# EAGLE design lcd-i2c (EAGLE 6.4)
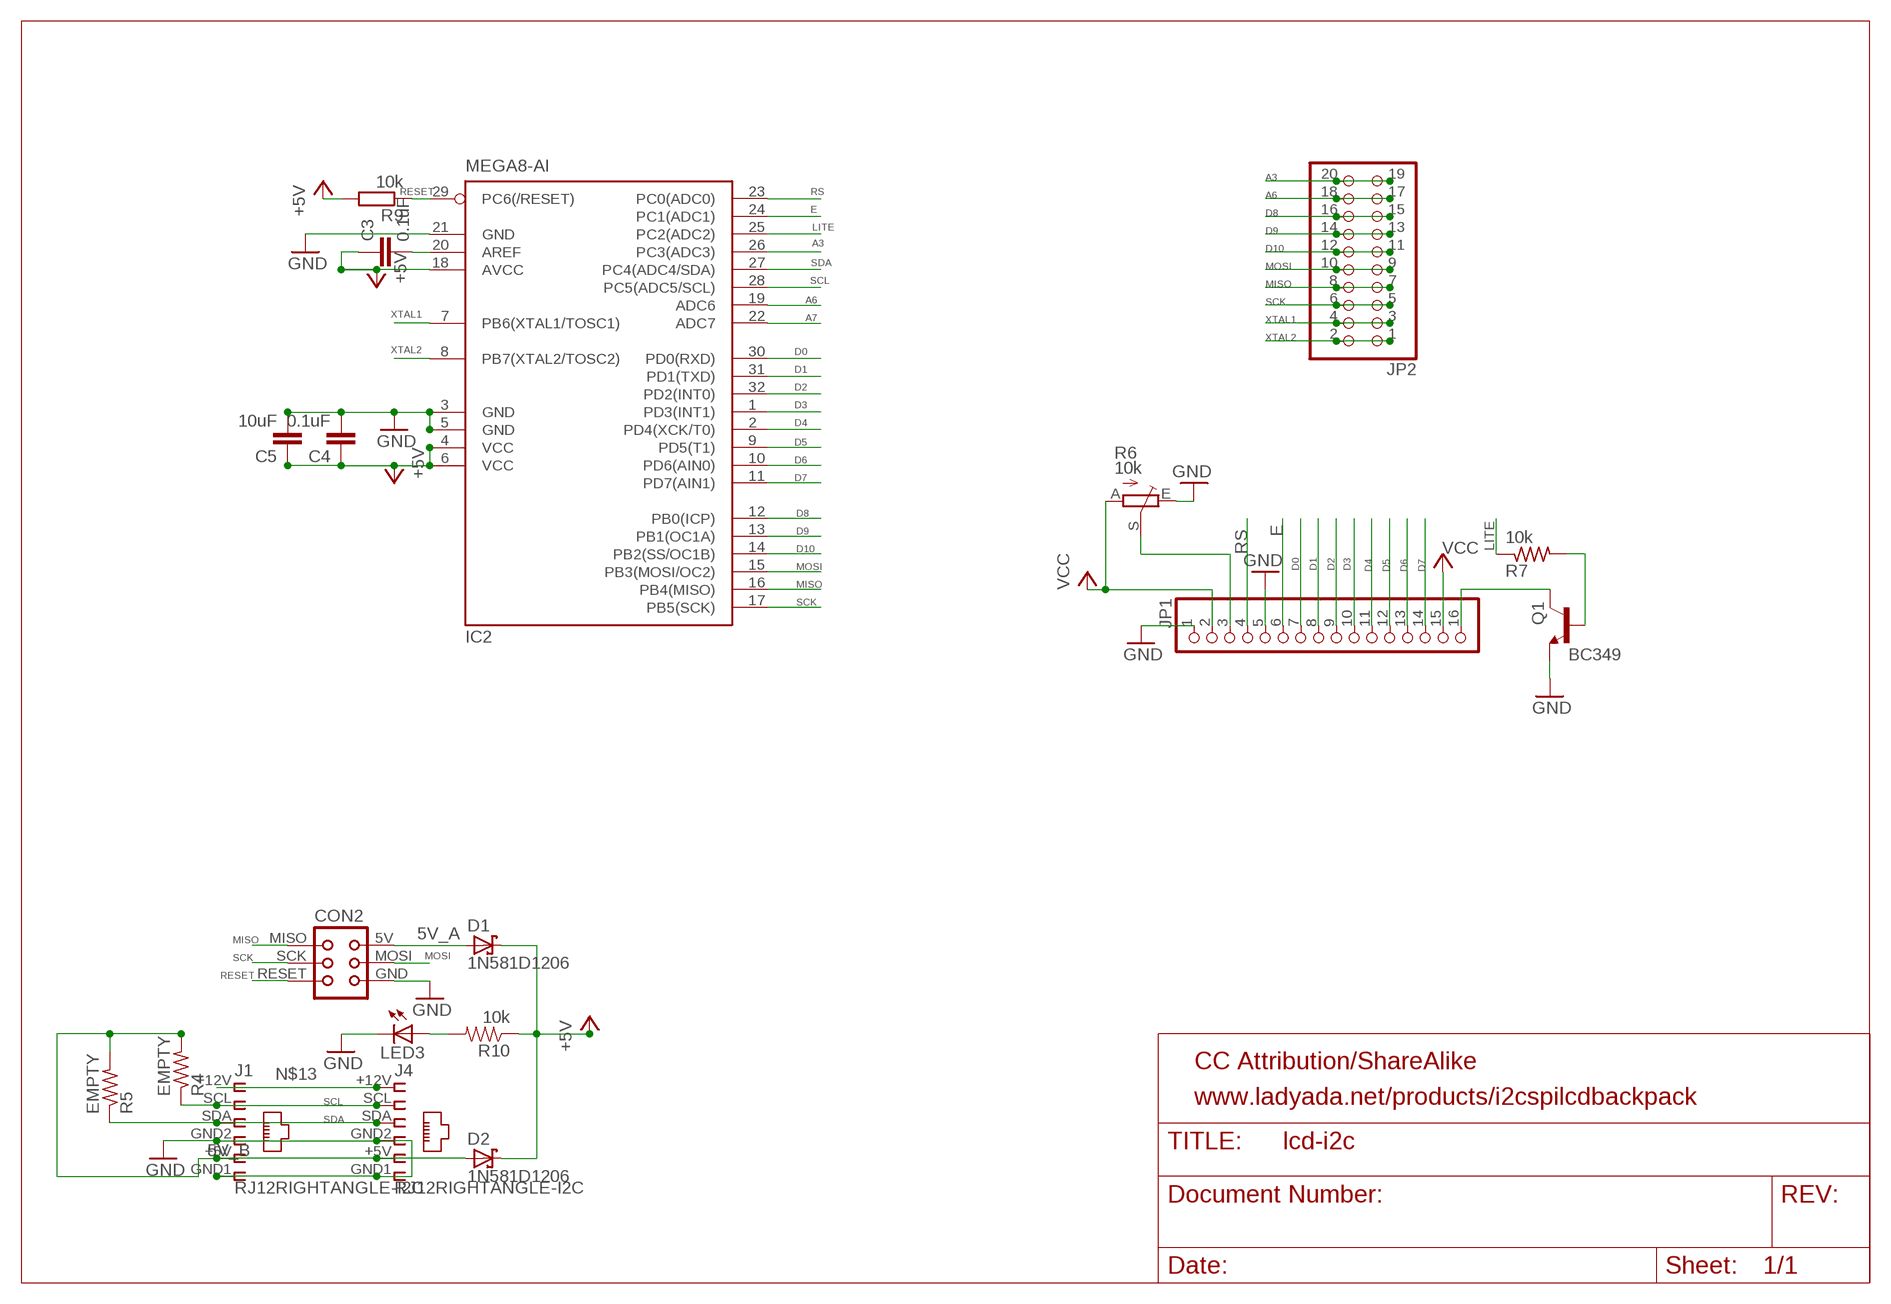
[diagram p0: schematic, sheet 1]

## Parts
C3  0.1uF  C-EUC1206  [C1206]
C4  0.1uF  C-EUC1206  [C1206]
C5  10uF  C-EUC1206  [C1206]
CON2  TINYISPTAG  [TC2030-MCP]
D1  1N581D1206  [LED-1206]
D2  1N581D1206  [LED-1206]
IC2  MEGA8-AI  [TQFP32-08]
J1  RJ12RIGHTANGLE-I2C  [RJ12-RIGHTANGLE-I2C]
J4  RJ12RIGHTANGLE-I2C  [RJ12-RIGHTANGLE-I2C]
JP1  PINHD-1X16  [1X16]
JP2  PINHD-2X10  [2X10]
LED3  LEDCHIP-LED0603  [CHIP-LED0603]
Q1  BC349  BC317-NPN-TO92-EBC  [TO92-EBC]
R4  EMPTY  R-US_M1206  [M1206]
R5  EMPTY  R-US_M1206  [M1206]
R6  10k  TRIM_EU-CA6V  [CA6V]
R7  10k  R-US_M1206  [M1206]
R9  10k  R-EU_M1206  [M1206]
R10  10k  RESISTOR0603-RES  [0603-RES]

## Nets
5V_A [i2c]: CON2.5V(VCC) D1.A
5V_B [power]: D2.A J1.+5V J4.+5V R4.2 R5.2
+5V [power]: C3.1 C4.1 C5.1 D1.C D2.C IC2.4(VCC) IC2.6(VCC) IC2.18(AVCC) R9.2 R10.1
A3: IC2.26(PC3(ADC3)) JP2.19 JP2.20
A6: IC2.19(ADC6) JP2.17 JP2.18
A7: IC2.22(ADC7)
D0: IC2.30(PD0(RXD)) JP1.7
D1: IC2.31(PD1(TXD)) JP1.8
D2: IC2.32(PD2(INT0)) JP1.9
D3: IC2.1(PD3(INT1)) JP1.10
D4: IC2.2(PD4(XCK/T0)) JP1.11
D5: IC2.9(PD5(T1)) JP1.12
D6: IC2.10(PD6(AIN0)) JP1.13
D7: IC2.11(PD7(AIN1)) JP1.14
D8: IC2.12(PB0(ICP)) JP2.15 JP2.16
D9: IC2.13(PB1(OC1A)) JP2.13 JP2.14
D10: IC2.14(PB2(SS/OC1B)) JP2.11 JP2.12
E: IC2.24(PC1(ADC1)) JP1.6
GND [power]: C4.2 C5.2 CON2.GND IC2.3(GND) IC2.5(GND) IC2.21(GND) J1.GND1 J1.GND2 J4.GND1 J4.GND2 JP1.1 JP1.5 LED3.C Q1.E R6.E
LITE: IC2.25(PC2(ADC2)) R7.1
MISO: CON2.MISO IC2.16(PB4(MISO)) JP2.7 JP2.8
MOSI: CON2.MOSI IC2.15(PB3(MOSI/OC2)) JP2.9 JP2.10
N$6: C3.2 IC2.20(AREF)
N$7: JP1.16 Q1.C
N$9: Q1.B R7.2
N$10: JP1.3 R6.S
N$13: J1.+12V J4.+12V
N$15: LED3.A R10.2
RESET: CON2.RESET IC2.29(PC6(/RESET)) R9.1
RS: IC2.23(PC0(ADC0)) JP1.4
SCK: CON2.SCK IC2.17(PB5(SCK)) JP2.5 JP2.6
SCL [i2c]: IC2.28(PC5(ADC5/SCL)) J1.SCL J4.SCL R4.1
SDA [i2c]: IC2.27(PC4(ADC4/SDA)) J1.SDA J4.SDA R5.1
VCC [power]: JP1.2 JP1.15 R6.A
XTAL1: IC2.7(PB6(XTAL1/TOSC1)) JP2.3 JP2.4
XTAL2: IC2.8(PB7(XTAL2/TOSC2)) JP2.1 JP2.2

## Notes on the sheet
- CC Attribution/ShareAlike
- www.ladyada.net/products/i2cspilcdbackpack

## Library data of the parts
C3-C5 = resistor:C-EU: CAPACITOR, European symbol
CON2 = lpatiny:TINYISP: CONNECTOR
D1 D2 = lpatiny:1N581*: 1.0A SCHOTTKY BARRIER RECTIFIER Source: http://www.diodes.com/datasheets/ds23001.pdf
IC2 = atmel:MEGA8: MICROCONTROLLER 8 Kbytes FLASH, 1 kbytes SRAM, 512 bytes EEPROM, USART, 6-channel 10 bit ADC, 2-channel 8 bit ADC Pin compatible with Atmega48, ATMega88, ATMega168 Source: avr.lbr; MPN: ATMEGA8-16AU; OC_FARNELL: 9171371; OC_NEWARK: 73M8863
J1 J4 = lpatiny:RJ12: CORCOM Modular RJ Jacks No Shield Source: www.tycoelectronics.com .. ENG_DS_1654001_1099_RJ_L_0507.pdf
JP1 = pinhead:PINHD-1X16: PIN HEADER
JP2 = pinhead:PINHD-2X10: PIN HEADER
LED3 = adafruit:LED: LED OSRAM: - CHIPLED LG R971, LG N971, LY N971, LG Q971, LY Q971, LO R971, LY R971 LH N974, LH R974 LS Q976, LO Q976, LY Q976 LO Q996 - Hyper CHIPLED LW Q18S LB Q993, LB Q99A, LB R99A - SideLED LS A670, LO A670, LY A670, LG A670, LP A670 LB A673, LV A673, LT A673, LW A673 LH A674 LY A675 LS A676, LA A676, LO A676, LY A676, LW A676 LS A679, LY A679, LG A679 - Hyper Micro SIDELED® LS Y876, LA Y876, LO Y876, LY Y876 LT Y87S - SmartLED LW L88C, LW L88S LB L89C, LB L89S, LG L890 LS L89K, LO L89K, LY L89K LS L896, LA L896, LO L896, LY L896 - TOPLED LS T670, LO T670, LY T670, LG T670, LP T670 LSG T670, LSP T670, LSY T670, LOP T670, LYG T670 LG T671, LOG T671, LSG T671 LB T673, LV T673, LT T673, LW T673 LH T674 LS T676, LA T676, LO T676, LY T676, LB T676, LH T676, LSB T676, LW T676 LB T67C, LV T67C, LT T67C, LS T67K, LO T67K, LY T67K, LW E67C LS E67B, LA E67B, LO E67B, LY E67B, LB E67C, LV E67C, LT E67C LW T67C LS T679, LY T679, LG T679 LS T770, LO T770, LY T770, LG T770, LP T770 LB T773, LV T773, LT T773, LW T773 LH T774 LS E675, LA E675, LY E675, LS T675 LS T776, LA T776, LO T776, LY T776, LB T776 LHGB T686 LT T68C, LB T68C - Hyper Mini TOPLED® LB M676 - Mini TOPLED Santana® LG M470 LS M47K, LO M47K, LY M47K Source: http://www.osram.convergy.de/
Q1 = transistor:*-NPN-: NPN Transistror BF959 corrected 2008.03.06
R4 R5 R7 = adafruit:R-US_: RESISTOR, American symbol
R6 = pot:TRIM_EU-: POTENTIOMETER
R9 = resistor:R-EU_: RESISTOR, European symbol
R10 = SparkFun:RESISTOR: Resistor Basic schematic elements and footprints for 0603, 1206, and PTH resistors.

## Net classes
0 default: width 0.305 mm
1 power: width 0.305 mm
2 i2c: width 0.305 mm

## Board
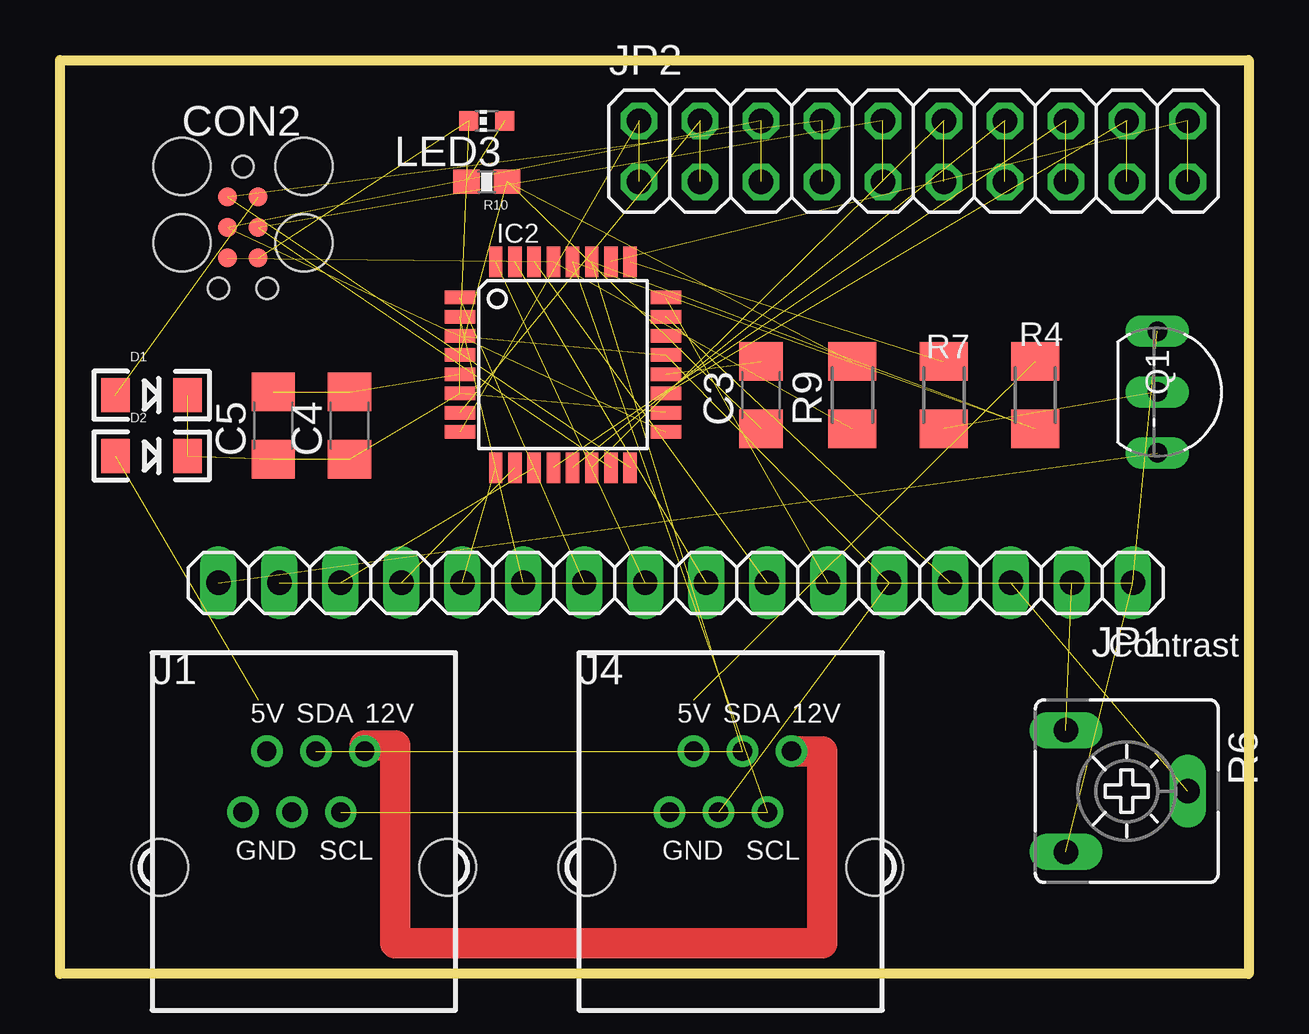
[diagram p1: board, top side]
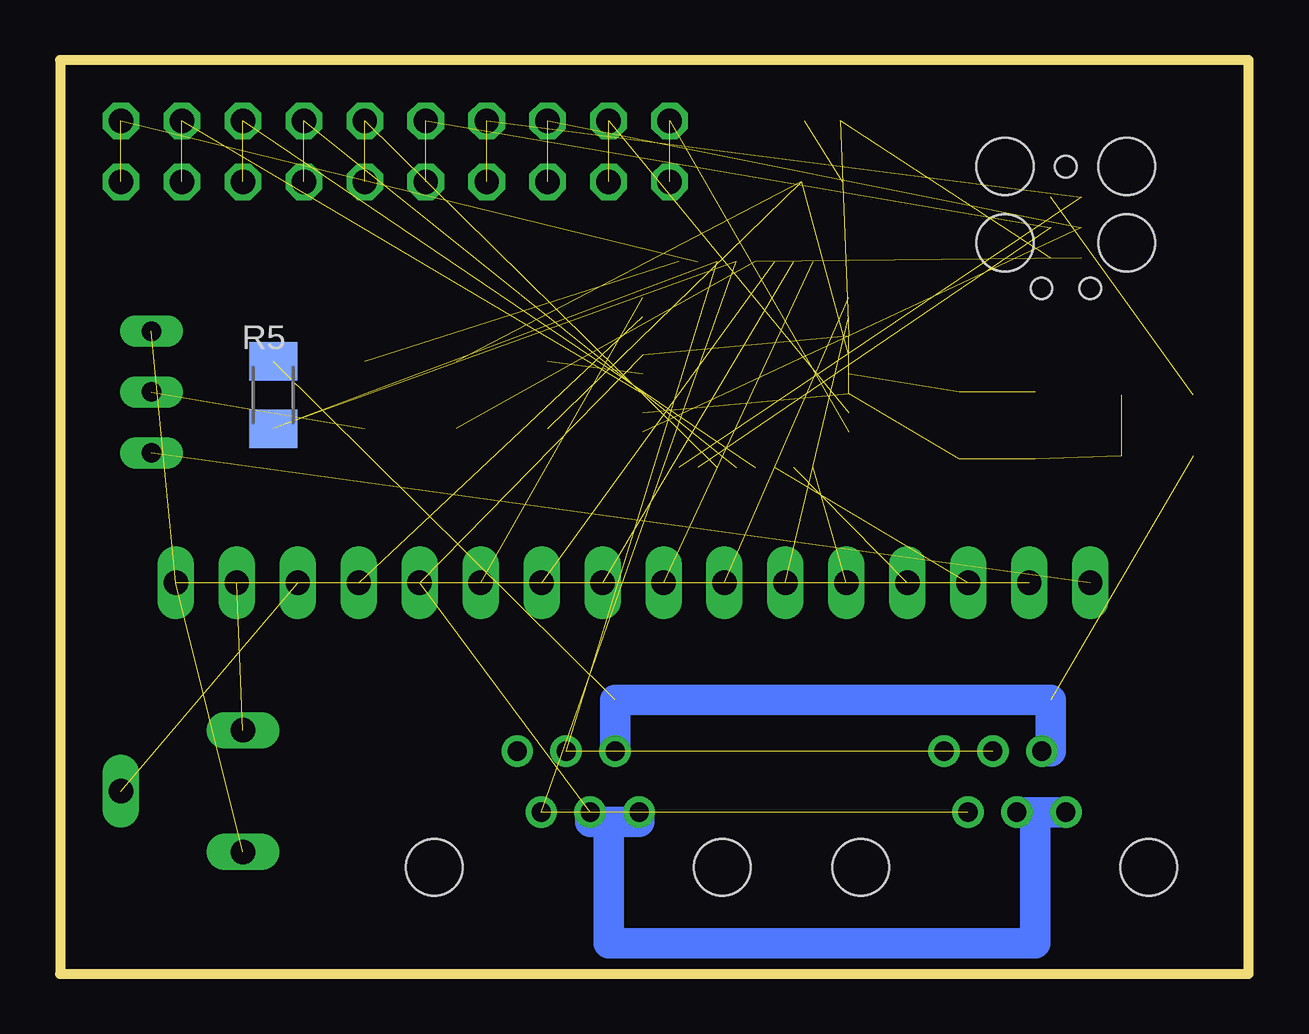
[diagram p2: board, bottom side, seen from below]

Size 49.53 x 38.1 mm. Coordinates in mm from the lower left corner, seen from the top.
Outline: 0,0 0,38.1 49.53,38.1 49.53,0 0,0
Copper layers (1*16): Top 0.035mm / dielectric 1.5mm / Bottom 0.035mm
Design rules "Fusion_eagle_rule_v1.1": minimum track width 6mil, minimum drill 12mil, track to track 6mil, track to pad 6mil, pad to pad 6mil, via to via 6mil, smd to smd 0mil, copper to edge 10mil, drill to drill 10mil, minimum pad ring 10mil, minimum via ring 6mil, stop-mask expansion 2mil, vias tented up to drill 100mil, thermal gap 10mil
vRestrict: area 15.2,19 to 26.7,22.9; area 15.2,27.9 to 26.7,31.8; area 14.6,19.7 to 18.4,31.1; area 23.5,19.7 to 27.3,31.1
Milling: 4 lines

### Footprints (pad centres in the part's own frame; a part is rotated, then mirrored left to right if it is on the bottom)
C1206 = smd 1.6 x 1.8: 1 -1.4,0; 2 1.4,0
TC2030-MCP = smd 0.787 x 0.787: 5V 1.27,0.635; GND 3.81,0.635; MISO 1.27,-0.635; MOSI 2.54,0.635; RESET 3.81,-0.635; SCK 2.54,-0.635 | hole 0.889: 0,0; 5.08,-1.016; 5.08,1.016 | hole 2.375: 0,2.54; 0,-2.54; 3.175,-2.54; 3.175,2.54
LED-1206 = smd 1.2 x 1.4: A -1.5,0; C 1.5,0
TQFP32-08 = smd 1.27 x 0.559: 1 -4.293,2.8; 2 -4.293,2; 3 -4.293,1.2; 4 -4.293,0.4; 5 -4.293,-0.4; 6 -4.293,-1.2; 7 -4.293,-2; 8 -4.293,-2.8; 17 4.293,-2.8; 18 4.293,-2; 19 4.293,-1.2; 20 4.293,-0.4; 21 4.293,0.4; 22 4.293,1.2; 23 4.293,2; 24 4.293,2.8 | smd 0.559 x 1.27: 9 -2.8,-4.293; 10 -2,-4.293; 11 -1.2,-4.293; 12 -0.4,-4.293; 13 0.4,-4.293; 14 1.2,-4.293; 15 2,-4.293; 16 2.8,-4.293; 25 2.8,4.293; 26 2,4.293; 27 1.2,4.293; 28 0.4,4.293; 29 -0.4,4.293; 30 -1.2,4.293; 31 -2,4.293; 32 -2.8,4.293
RJ12-RIGHTANGLE-I2C = drill 0.8 pad 1.3: +5V -1.54,4.84; +12V 2.54,4.84; GND1 -2.54,2.3; GND2 -0.5,2.3; SCL 1.54,2.3; SDA 0.5,4.84 | hole 2.36: -6,0; 6,0
1X16 = drill 1.016 long: 1 -19.05,0; 2 -16.51,0; 3 -13.97,0; 4 -11.43,0; 5 -8.89,0; 6 -6.35,0; 7 -3.81,0; 8 -1.27,0; 9 1.27,0; 10 3.81,0; 11 6.35,0; 12 8.89,0; 13 11.43,0; 14 13.97,0; 15 16.51,0; 16 19.05,0
2X10 = drill 1.016 octagon: 1 -11.43,-1.27; 2 -11.43,1.27; 3 -8.89,-1.27; 4 -8.89,1.27; 5 -6.35,-1.27; 6 -6.35,1.27; 7 -3.81,-1.27; 8 -3.81,1.27; 9 -1.27,-1.27; 10 -1.27,1.27; 11 1.27,-1.27; 12 1.27,1.27; 13 3.81,-1.27; 14 3.81,1.27; 15 6.35,-1.27; 16 6.35,1.27; 17 8.89,-1.27; 18 8.89,1.27; 19 11.43,-1.27; 20 11.43,1.27
CHIP-LED0603 = smd 0.8 x 0.8: A 0,-0.75; C 0,0.75
TO92-EBC = drill 0.813 long: B 0,-1.27; C 2.54,-1.27; E -2.54,-1.27
M1206 = smd 1.6 x 2: 1 -1.4,0; 2 1.4,0
CA6V = drill 1.016 long: A -2.54,-2.54; E 2.54,-2.54; S 0,2.54
0603-RES = smd 1.1 x 1: 1 -0.85,0; 2 0.85,0

### Placement (x,y rotation side)
C3  29.21,24.13 90 top
C4  12.06,22.86 90 top
C5  8.89,22.86 90 top
CON2  7.62,33.66 270 top
D1  3.81,24.13 0 top
D2  3.81,21.59 0 top
IC2  20.95,25.4 0 top
J1  10.16,4.45 0 top
J4  27.94,4.45 0 top
JP1  25.65,16.31 180 top
JP2  35.56,34.29 0 top
LED3  17.78,35.56 90 top
Q1  46.99,24.26 270 top
R4  40.64,24.13 90 top
R5  40.64,24.13 90 bottom
R6  44.45,7.62 270 top
R7  36.83,24.13 270 top
R9  33.02,24.13 90 top
R10  17.78,33.02 180 top

### Tracks (layer width: path | path; a pad name or v marks a point on that pad's centre or on a via)
5V_A  (1 unrouted)
5V_B  (3 unrouted)
  Bottom 1.27: J1.+5V 8.26,9.29 8.26,11.43 26.4,11.43 J4.+5V
+5V  (9 unrouted)
A3  (2 unrouted)
A6  (2 unrouted)
D0  (1 unrouted)
D1  (1 unrouted)
D2  (1 unrouted)
D3  (1 unrouted)
D4  (1 unrouted)
D5  (1 unrouted)
D6  (1 unrouted)
D7  (1 unrouted)
D8  (2 unrouted)
D9  (2 unrouted)
D10  (2 unrouted)
E  (1 unrouted)
GND  (11 unrouted)
  Bottom 1.27: J1.GND1 J1.GND2 8.89,6.75 8.89,1.27 26.67,1.27 26.67,6.35 | 26.67,6.35 27.44,6.35 J4.GND2 | 26.67,6.35 25.4,6.35 J4.GND1
LITE  (1 unrouted)
MISO  (3 unrouted)
MOSI  (3 unrouted)
N$6  (1 unrouted)
N$7  (1 unrouted)
N$9  (1 unrouted)
N$10  (1 unrouted)
N$13
  Top 1.27: J4.+12V 31.75,9.29 31.75,1.27 13.97,1.27 13.97,9.53 12.7,9.53 J1.+12V
N$15  (1 unrouted)
RESET  (2 unrouted)
RS  (1 unrouted)
SCK  (3 unrouted)
SCL  (3 unrouted)
SDA  (3 unrouted)
VCC  (2 unrouted)
XTAL1  (2 unrouted)
XTAL2  (2 unrouted)

### Text on the board
tPlace: Contrast